# EAGLE design CAN (EAGLE 9.4.0)
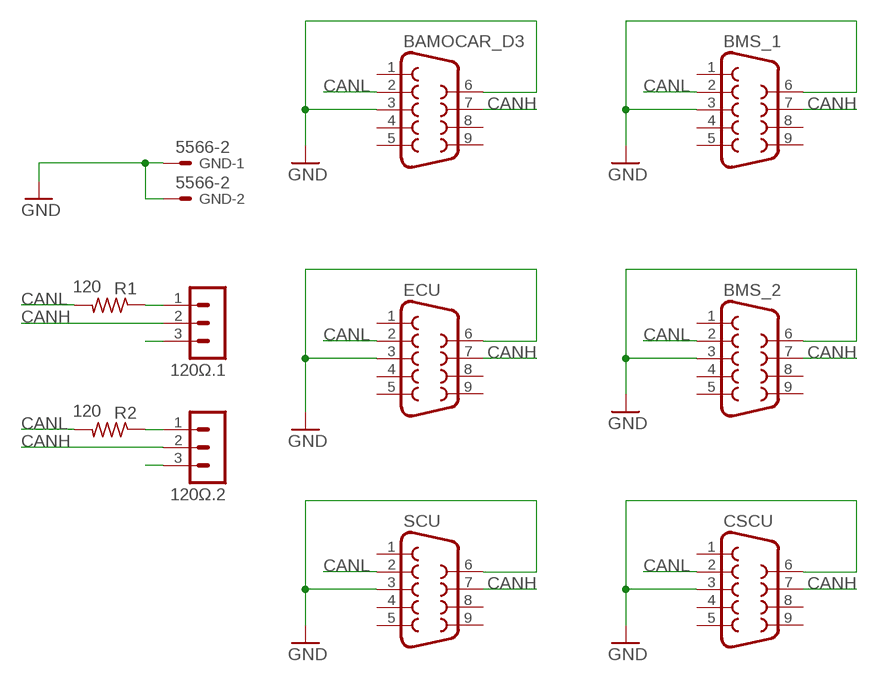
[diagram p0: schematic, sheet 1]

## Parts
120Ω.1  MA03-1  [MA03-1]
120Ω.2  MA03-1  [MA03-1]
BAMOCAR_D3  F09VP  [F09VP]
BMS_1  F09VP  [F09VP]
BMS_2  F09VP  [F09VP]
CSCU  F09VP  [F09VP]
ECU  F09VP  [F09VP]
GND  5566-2  [5566-2]
R1  120  R-US_R0805  [R0805]
R2  120  R-US_R0805  [R0805]
SCU  F09VP  [F09VP]

## Nets
CANH: 120Ω.1.2 120Ω.2.2 BAMOCAR_D3.7 BMS_1.7 BMS_2.7 CSCU.7 ECU.7 SCU.7
CANL: BAMOCAR_D3.2 BMS_1.2 BMS_2.2 CSCU.2 ECU.2 R1.2 R2.2 SCU.2
GND: BAMOCAR_D3.3 BAMOCAR_D3.6 BMS_1.3 BMS_1.6 BMS_2.3 BMS_2.6 CSCU.3 CSCU.6 ECU.3 ECU.6 GND.1 GND.2 SCU.3 SCU.6
N$2: 120Ω.2.3
N$3: 120Ω.2.1 R2.1
N$4: 120Ω.1.1 R1.1
N$6: 120Ω.1.3
Unconnected: BAMOCAR_D3.1 BAMOCAR_D3.4 BAMOCAR_D3.5 BAMOCAR_D3.8 BAMOCAR_D3.9 BMS_1.1 BMS_1.4 BMS_1.5 BMS_1.8 BMS_1.9 BMS_2.1 BMS_2.4 BMS_2.5 BMS_2.8 BMS_2.9 CSCU.1 CSCU.4 CSCU.5 CSCU.8 CSCU.9 ECU.1 ECU.4 ECU.5 ECU.8 ECU.9 SCU.1 SCU.4 SCU.5 SCU.8 SCU.9

## Library data of the parts
120Ω.1 120Ω.2 = con-lstb:MA03-1: PIN HEADER; OC_FARNELL: unknown; OC_NEWARK: unknown
BAMOCAR_D3 BMS_1 BMS_2 CSCU ECU SCU = con-subd:F09: SUB-D; OC_FARNELL: unknown; OC_NEWARK: unknown
GND = con-molex:5566-2: Mini FIT connector 2 pol Source: http://www.molex.com; MF: MOLEX; OC_FARNELL: 1822072; OC_NEWARK: unknown
R1 R2 = rcl:R-US_: RESISTOR, American symbol; SPICEPREFIX: R

## Board
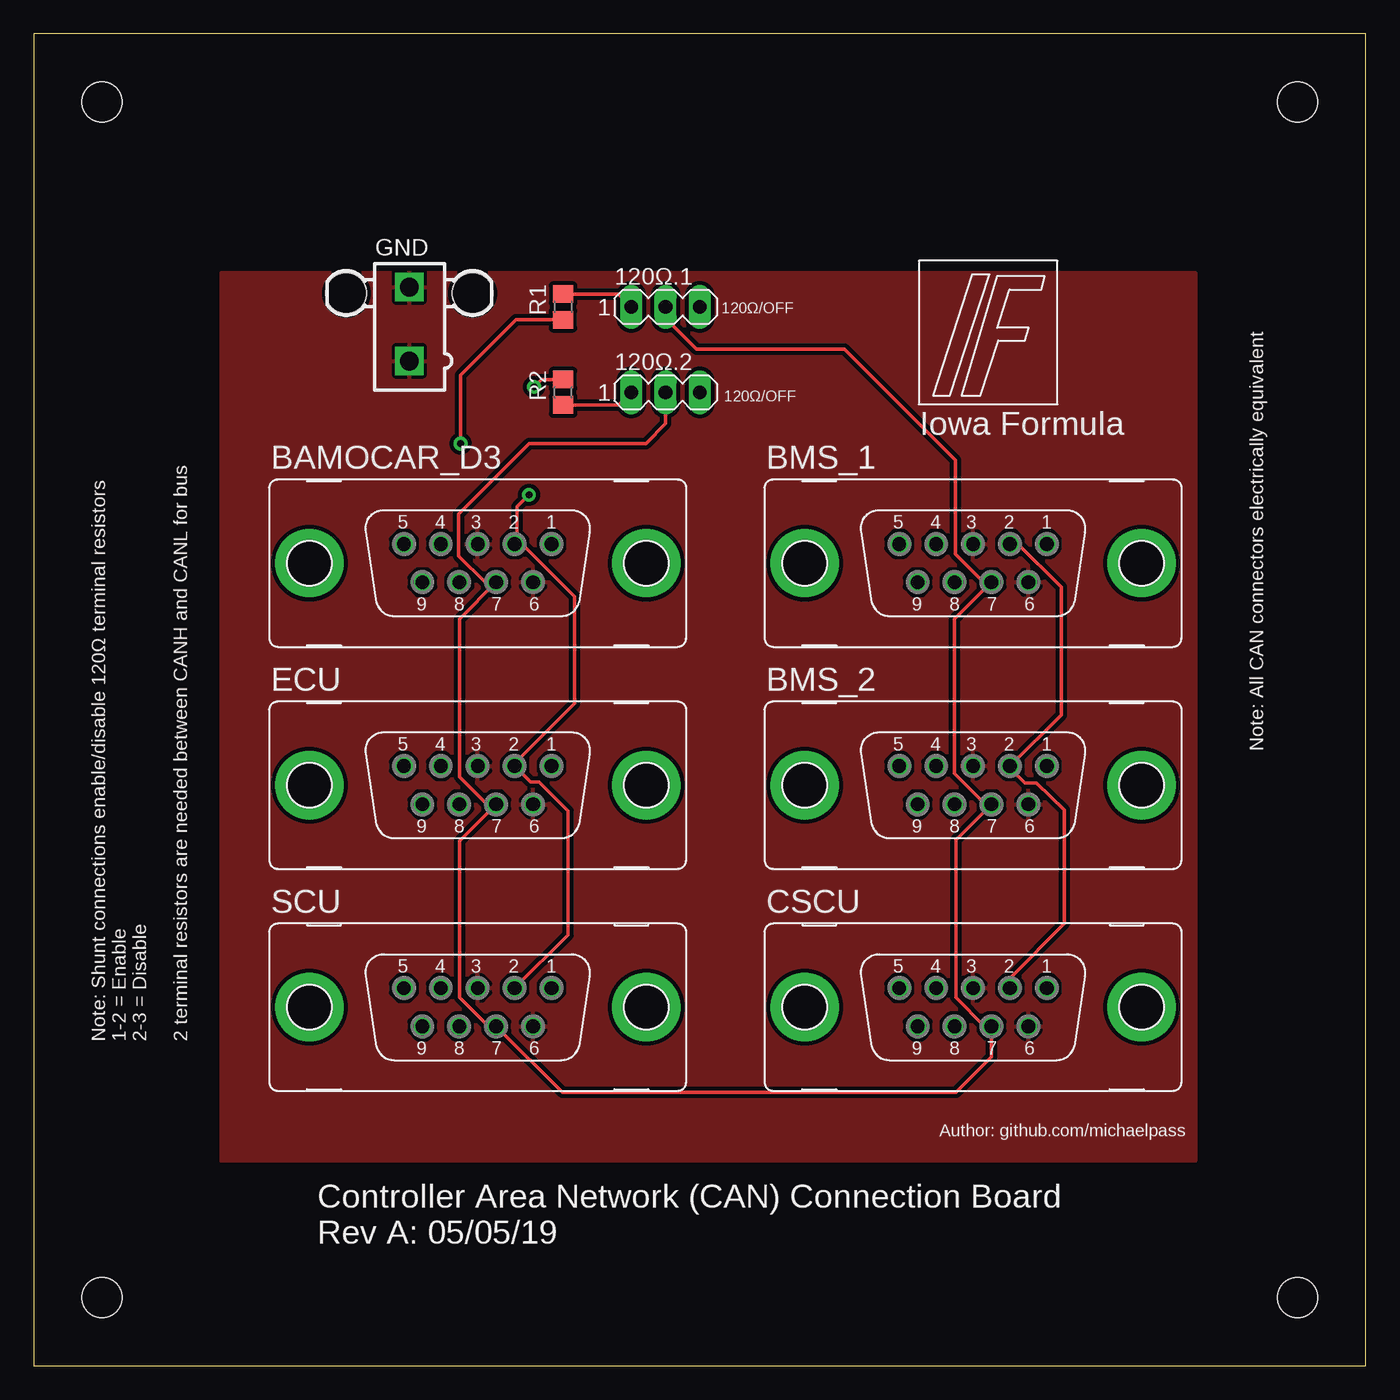
[diagram p1: board, top side]
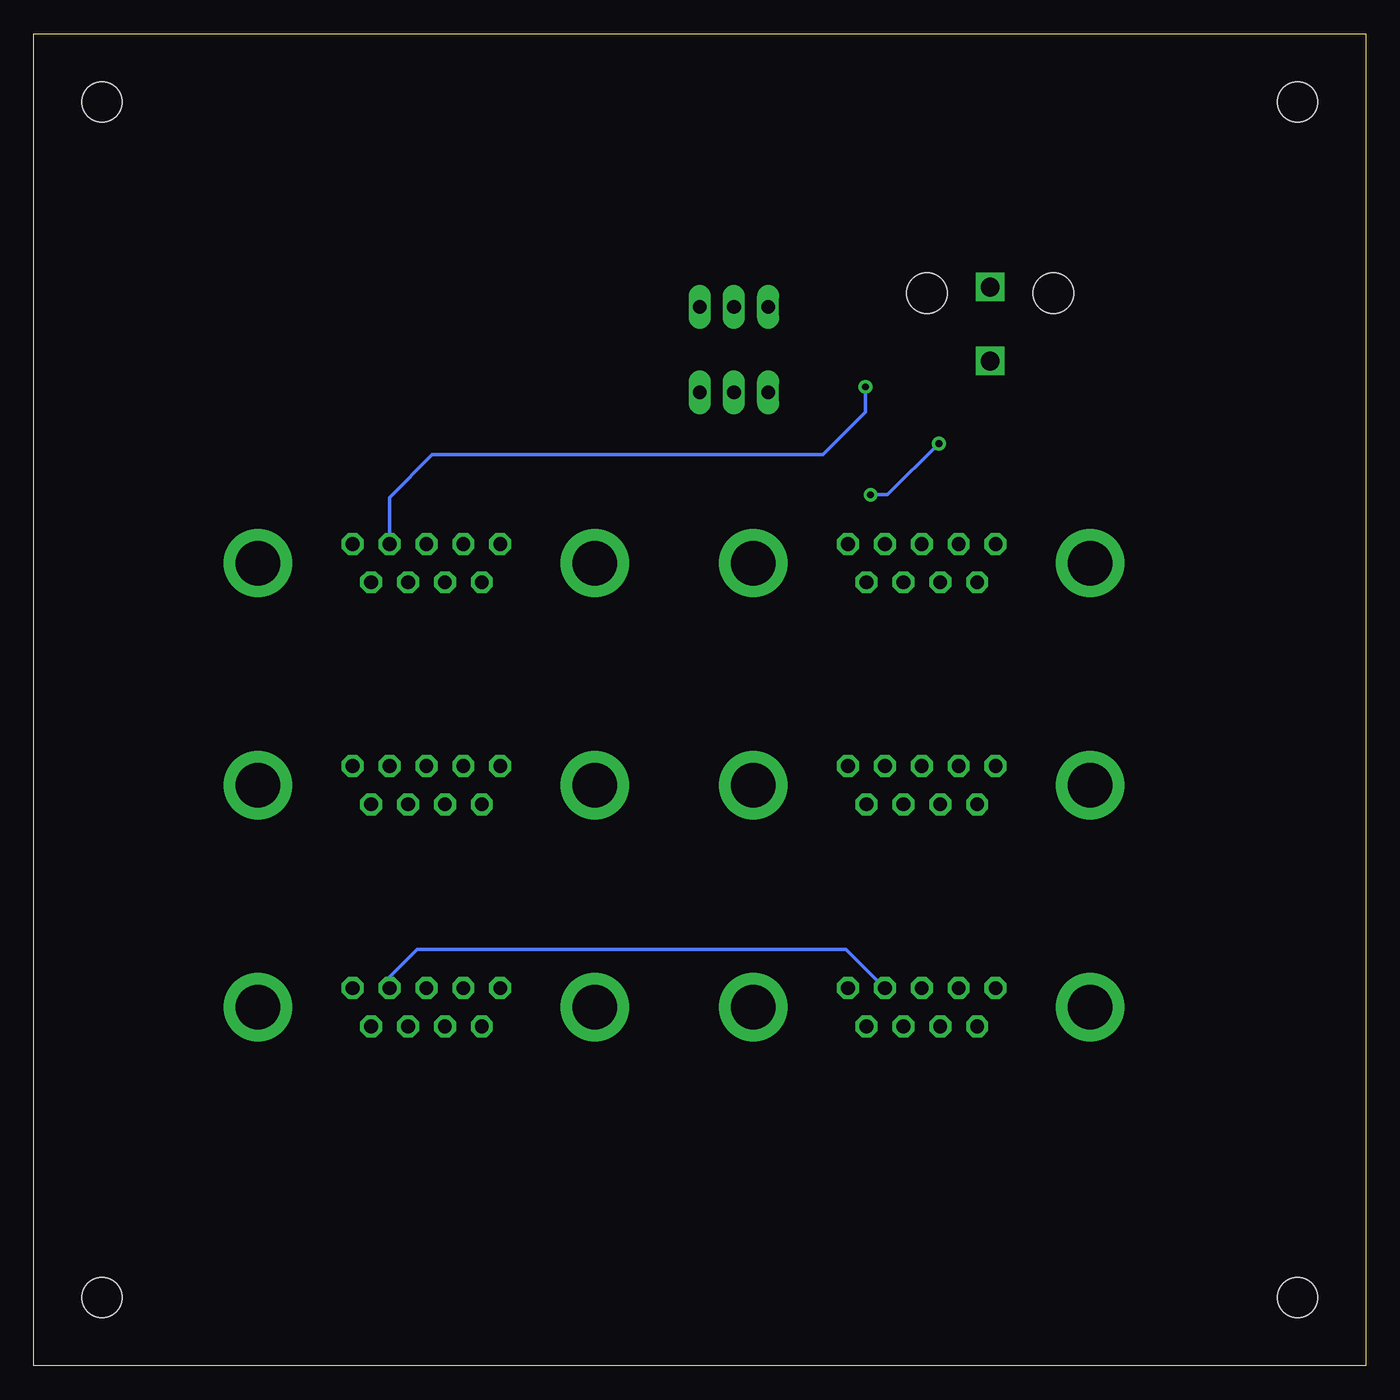
[diagram p2: board, bottom side, seen from below]

Size 99.06 x 99.06 mm. Coordinates in mm from the lower left corner, seen from the top.
Outline: 0,0 99.06,0 99.06,99.06 0,99.06 0,0
Copper layers (1*16): Top 0.035mm / dielectric 1.5mm / Bottom 0.035mm
Design rules "default *": minimum track width 8mil, minimum drill 20mil, track to track 8mil, track to pad 8mil, pad to pad 8mil, via to via 8mil, smd to smd 8mil, copper to edge 10mil, drill to drill 8mil, minimum pad ring 12mil, minimum via ring 10mil, stop-mask expansion 4mil, vias tented up to drill 25mil, thermal gap 10mil
Holes 3 mm at 93.98,93.98 5.08,93.98 5.08,5.08 93.98,5.08

### Footprints (pad centres in the part's own frame; a part is rotated, then mirrored left to right if it is on the bottom)
MA03-1 = drill 1.016 long: 1 -2.54,0; 2 0,0; 3 2.54,0
F09VP = drill 1.016 octagon: 1 5.486,1.422; 2 2.743,1.422; 3 0,1.422; 4 -2.743,1.422; 5 -5.486,1.422; 6 4.115,-1.422; 7 1.372,-1.422; 8 -1.372,-1.422; 9 -4.115,-1.422 | drill 3.302 pad 5.08: G1 -12.522,0; G2 12.522,0
5566-2 = drill 1.4 square: 1 0,-2.75; 2 0,2.75 | hole 3: 4.7,2.29; -4.7,2.29
R0805 = smd 1.3 x 1.5: 1 -0.95,0; 2 0.95,0

### Placement (x,y rotation side)
120Ω.1  46.99,78.74 0 top
120Ω.2  46.99,72.39 0 top
BAMOCAR_D3  33.02,59.69 0 top
BMS_1  69.85,59.69 0 top
BMS_2  69.85,43.18 0 top
CSCU  69.85,26.67 0 top
ECU  33.02,43.18 0 top
GND  27.94,77.47 0 top
R1  39.37,78.74 270 top
R2  39.37,72.39 90 top
SCU  33.02,26.67 0 top

### Tracks (layer width: path | path; a pad name or v marks a point on that pad's centre or on a via)
CANH
  Top 0.254: 120Ω.2.2 46.99,70.05 45.52,68.58 36.83,68.58 31.6,63.35 31.6,60.22 33.55,58.27 BAMOCAR_D3.7 31.67,55.55 31.67,43.79 33.71,41.76 ECU.7 31.67,39.04 31.67,27.41 33.83,25.25 SCU.7 39.32,20.32 68.58,20.32 71.22,22.96 CSCU.7 70.71,25.25 68.58,27.38 68.58,39.12 BMS_2.7 70.76,41.76 68.48,44.04 68.48,55.52 BMS_1.7 70.64,58.27 68.56,60.35 68.56,67.33 60.27,75.62 49.28,75.62 46.99,77.9 120Ω.1.2
CANL  (via drill 0.51)
  Top 0.254: CSCU.2 72.59,28.83 76.66,32.89 76.66,41.34 74.58,43.33 73.71,43.33 72.57,44.48 72.57,44.58 BMS_2.2 76.4,48.41 76.4,57.91 73.13,61.19 72.67,61.19 BMS_1.2 | SCU.2 39.73,32.05 39.73,41.27 37.59,43.41 36.96,43.41 ECU.2 35.76,44.81 40.22,49.26 40.22,57.21 36.32,61.11 BAMOCAR_D3.2 35.94,61.29 35.94,63.88 v36.83,64.77 | R1.2 35.88,77.79 31.75,73.66 v31.75,68.58 | R2.2 37.76,73.34 v37.21,72.8
  Bottom 0.254: v31.75,68.58 35.56,64.77 v36.83,64.77 | SCU.2 36.93,29.26 36.96,29.26 38.66,30.96 70.54,30.96 72.59,28.91 CSCU.2 | v37.21,72.8 37.21,70.92 40.39,67.74 69.42,67.74 72.59,64.57 BMS_1.2
GND
  pour Top (isolate 0.305): 13.97,81.28 86.36,81.28 86.36,15.24 13.97,15.24
N$3
  Top 0.254: R2.1 43.5,71.44 120Ω.2.1
N$4
  Top 0.254: R1.1 43.5,79.69 120Ω.1.1

### Text on the board
tPlace: Note: All CAN connectors electrically equivalent | Note: Shunt connections enable/disable 120Ω terminal resistors / 1-2 = Enable / 2-3 = Disable / / 2 terminal resistors are needed between CANH and CANL for bus
tNames: 120Ω/OFF | 120Ω/OFF | Iowa Formula | Author: github.com/michaelpass | Controller Area Network (CAN) Connection Board / Rev A: 05/05/19